# EAGLE design ESP32FishLightBoard (EAGLE 9.6.2)
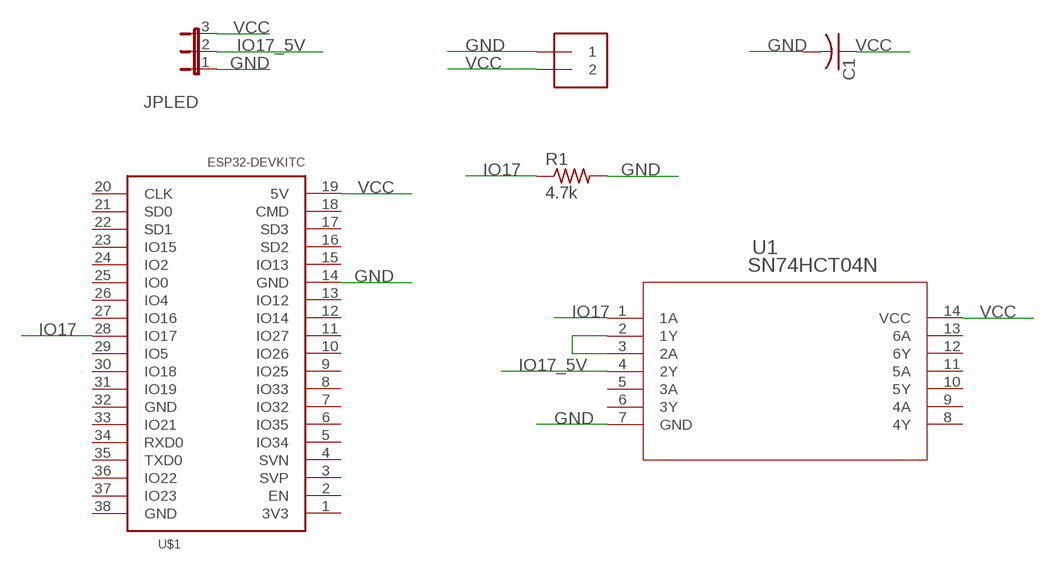
[diagram p0: schematic, sheet 1]

## Parts
C1  C-US025-040X050  [C025-040X050]
J1  1X2-3.5MM  [1X2-3.5MM]
JPLED  JP2E  [JP2]
R1  4.7k  FLIPFLOP-RES  [0805-THM]
U1  SN74HCT04N  [N14]
U$1  ESP32DEVKITC  [ESP32-DEVKITC]

## Nets
GND [thicc]: C1.2 J1.1 JPLED.1 R1.2 U1.7(GND) U$1.14(GND)
IO17 [thicc]: R1.1 U1.1(1A) U$1.28(IO17)
IO17_5V [thicc]: JPLED.2 U1.4(2Y)
N$1 [thicc]: U1.2(1Y) U1.3(2A)
VCC [thicc]: C1.1 J1.2 JPLED.3 U1.14(VCC) U$1.19(5V)
Unconnected: U1.5(3A) U1.6(3Y) U1.8(4Y) U1.9(4A) U1.10(5Y) U1.11(5A) U1.12(6Y) U1.13(6A) U$1.1(3V3) U$1.2(EN) U$1.3(SVP) U$1.4(SVN) U$1.5(IO34) U$1.6(IO35) U$1.7(IO32) U$1.8(IO33) U$1.9(IO25) U$1.10(IO26) U$1.11(IO27) U$1.12(IO14) U$1.13(IO12) U$1.15(IO13) U$1.16(SD2) U$1.17(SD3) U$1.18(CMD) U$1.20(CLK) U$1.21(SD0) U$1.22(SD1) U$1.23(IO15) U$1.24(IO2) U$1.25(IO0) U$1.26(IO4) U$1.27(IO16) U$1.29(IO5) U$1.30(IO18) U$1.31(IO19) U$1.32(GND) U$1.33(IO21) U$1.34(RXD0) U$1.35(TXD0) U$1.36(IO22) U$1.37(IO23) U$1.38(GND)

## Library data of the parts
C1 = adafruit:C-US: CAPACITOR, American symbol
J1 = adafruit:1X2: 3.5mm Terminal block http://www.ladyada.net/library/pcb/eaglelibrary.html
JPLED = jumper:JP2E: JUMPER
R1 = adafruit:FLIPFLOP-RES: Flip Flop resistor An 0805 resistor inside a standard 1/4W 5% resistor. Makes for easy mods
U1 = UltralibrarianImported:SN74HCT04N; DATASHEET_URL: http://www.ti.com/lit/gpn/SN74HCT04; DESCRIPTION: Hex Inverters; FAMILY_NAME: INVERTING BUFFER/DRIVER; GENERIC_PART_NUMBER: SN74HCT04; INDUSTRY_STD_PKG_TYPE: PDIP; MANUFACTURER: Texas Instruments; PACKAGE_DESIGNATOR: N; PIN_COUNT: 14
U$1 = ESP32-DEVKITC:ESP32DEVKITC

## Net classes
1 thicc: width 0.254 mm, clearance 0.254 mm

## Board
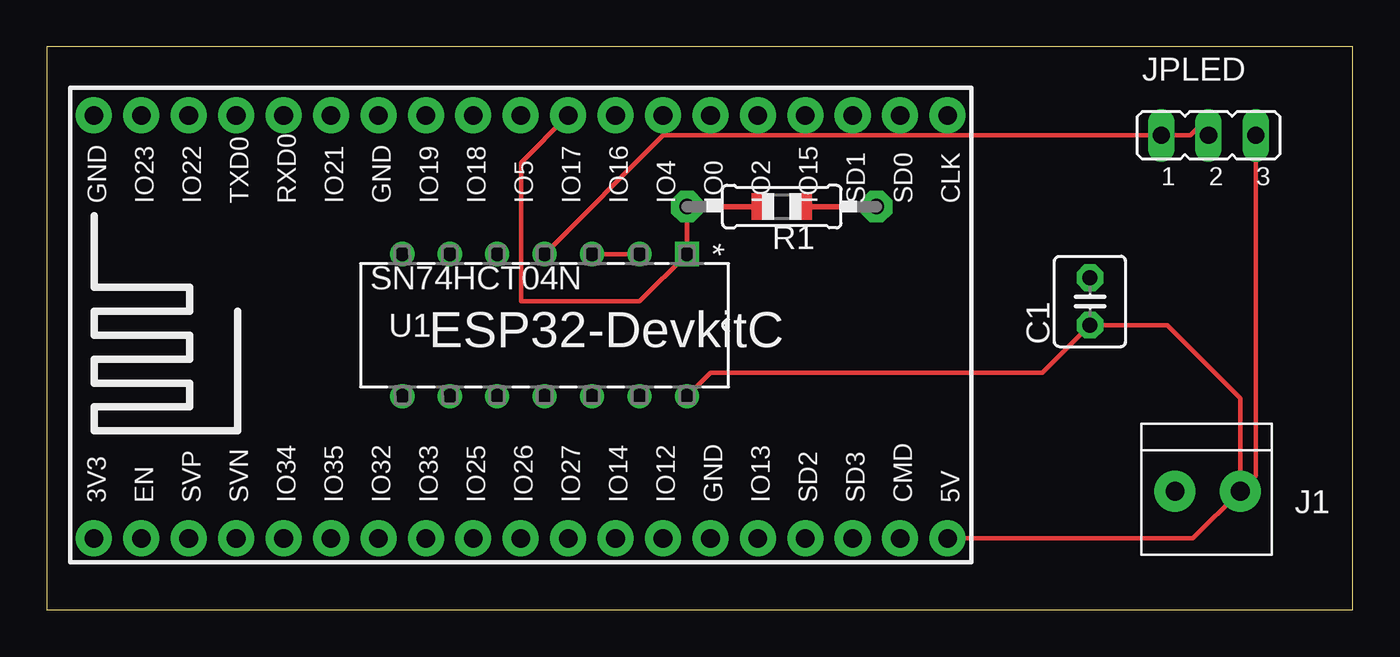
[diagram p1: board, top side]
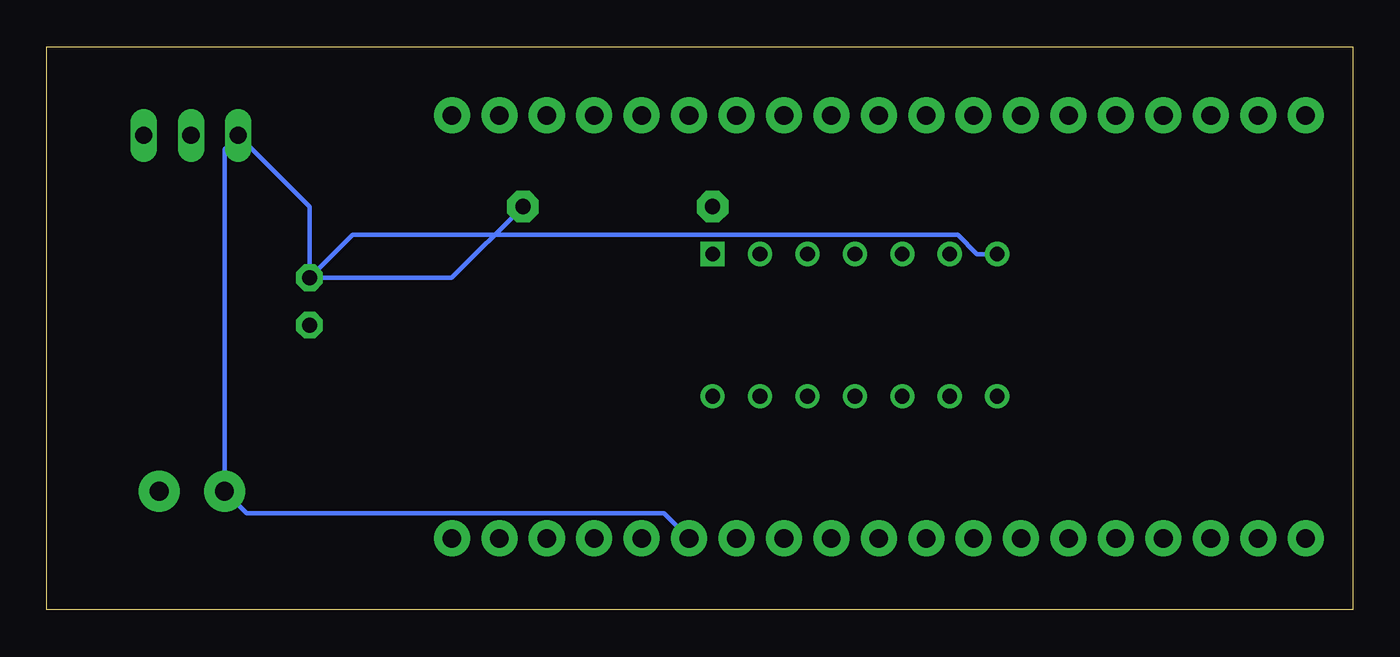
[diagram p2: board, bottom side, seen from below]

Size 69.96 x 30.15 mm. Coordinates in mm from the lower left corner, seen from the top.
Outline: 0,0 69.96,0 69.96,30.15 0,30.15 0,0
Copper layers (1*16): Top 0.035mm / dielectric 1.5mm / Bottom 0.035mm
Design rules "default": minimum track width 6mil, minimum drill 0.35mm, track to track 6mil, track to pad 6mil, pad to pad 6mil, via to via 6mil, smd to smd 6mil, copper to edge 40mil, drill to drill 6mil, minimum pad ring 10mil, minimum via ring 8mil, stop-mask expansion 4mil, vias tented up to drill 0mil, thermal gap 10mil

### Footprints (pad centres in the part's own frame; a part is rotated, then mirrored left to right if it is on the bottom)
C025-040X050 = drill 0.813 pad 1.422 octagon: 1 -1.27,0; 2 1.27,0
1X2-3.5MM = drill 1 pad 2.184: 1 1.8,0; 2 -1.7,0
JP2 = drill 0.914 long: 1 -2.54,0; 2 0,0; 3 2.54,0
0805-THM = drill 0.813 pad 1.676 octagon: 1 -5.08,0; 2 5.08,0
N14 = drill 0.787 pad 1.295 square: 1 -7.62,15.24 | drill 0.787 pad 1.295: 2 -7.62,12.7; 3 -7.62,10.16; 4 -7.62,7.62; 5 -7.62,5.08; 6 -7.62,2.54; 7 -7.62,0; 8 0,0; 9 0,2.54; 10 0,5.08; 11 0,7.62; 12 0,10.16; 13 0,12.7; 14 0,15.24
ESP32-DEVKITC = drill 1 pad 1.93: 1 -22.87,-11.42; 2 -20.33,-11.42; 3 -17.79,-11.42; 4 -15.25,-11.42; 5 -12.71,-11.42; 6 -10.17,-11.42; 7 -7.63,-11.42; 8 -5.09,-11.42; 9 -2.55,-11.42; 10 -0.01,-11.42; 11 2.53,-11.42; 12 5.07,-11.42; 13 7.61,-11.42; 14 10.15,-11.42; 15 12.69,-11.42; 16 15.23,-11.42; 17 17.77,-11.42; 18 20.31,-11.42; 19 22.85,-11.42; 20 22.85,11.23; 21 20.31,11.23; 22 17.77,11.23; 23 15.23,11.23; 24 12.69,11.23; 25 10.15,11.23; 26 7.61,11.23; 27 5.07,11.23; 28 2.53,11.23; 29 -0.01,11.23; 30 -2.55,11.23; 31 -5.09,11.23; 32 -7.63,11.23; 33 -10.17,11.23; 34 -12.71,11.23; 35 -15.25,11.23; 36 -17.79,11.23; 37 -20.33,11.23; 38 -22.87,11.23

### Placement (x,y rotation side)
C1  55.88,16.51 90 top
J1  62.23,6.35 180 top
JPLED  62.23,25.4 0 top
R1  39.37,21.59 0 top
U1  19.05,11.43 270 top
U$1  25.4,15.24 0 top

### Tracks (layer width: path | path; a pad name or v marks a point on that pad's centre or on a via)
GND
  Top 0.254: 60.38,6.38 J1.1 60.45,6.45
  Bottom 0.254: U$1.14 36.9,5.17 59.25,5.17 J1.1 60.43,24.66 JPLED.1 55.88,21.59 C1.2 | U1.7 20.14,19.05 21.16,20.08 53.58,20.08 C1.2 | C1.2 48.26,17.78 R1.2
IO17
  Top 0.254: U$1.28 25.4,23.94 25.4,16.51 31.75,16.51 U1.1 R1.1
IO17_5V
  Top 0.254: U1.4 33.02,25.4 61.24,25.4 62.23,26.39 JPLED.2
N$1
  Top 0.254: U1.3 U1.2
VCC
  Top 0.254: U$1.19 61.4,3.82 J1.2 | 63.88,6.45 J1.2 | U1.14 35.56,12.7 53.34,12.7 C1.1 60.02,15.24 63.93,11.33 J1.2 | J1.2 64.77,7.19 JPLED.3